# Altium schematic sheet Xcore10.SchDoc
size A
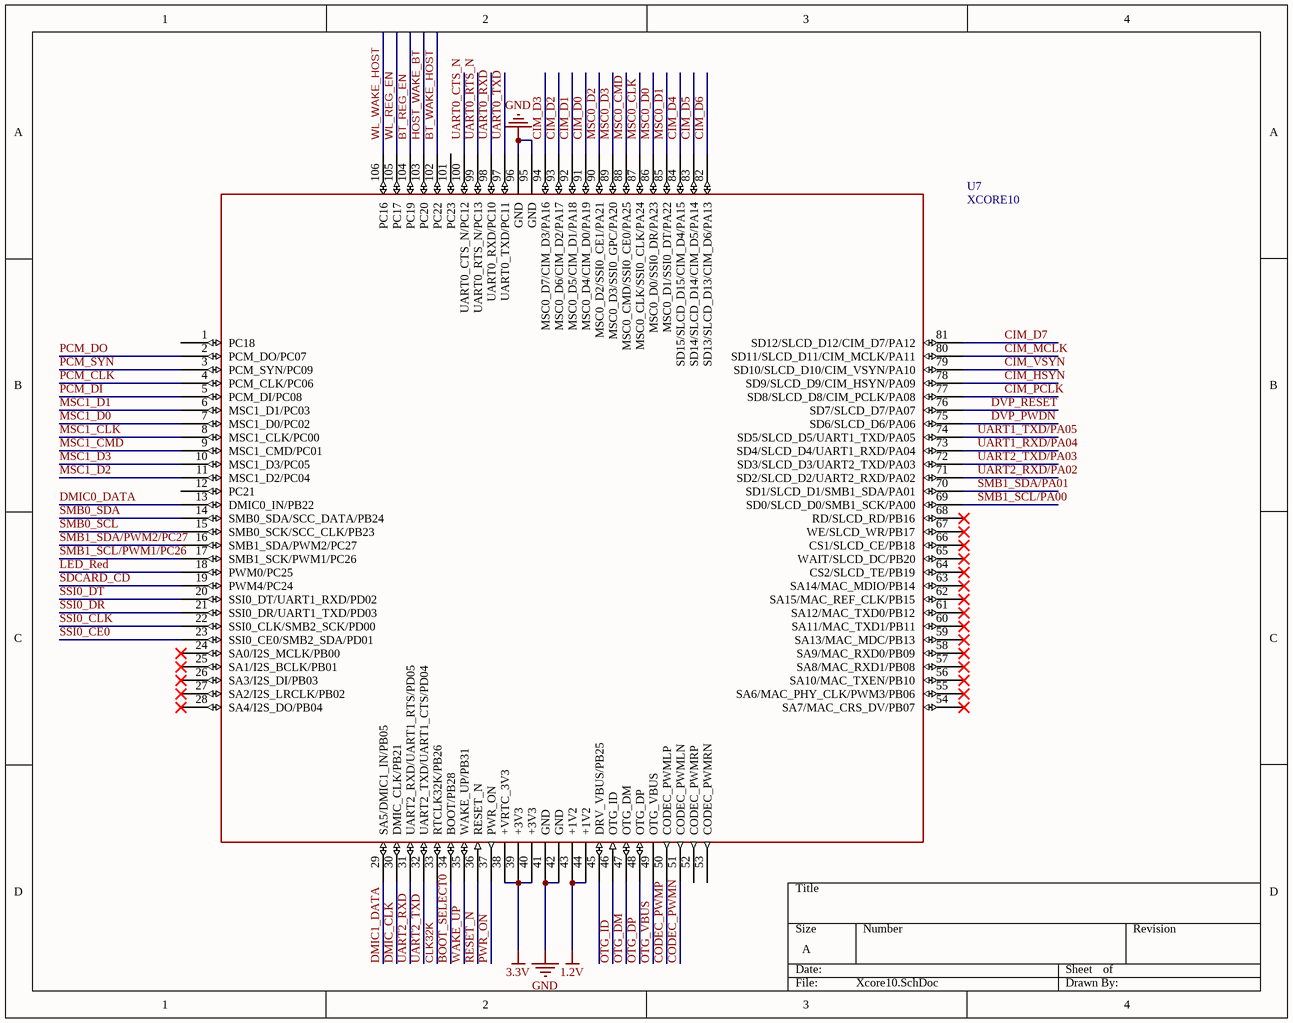
[diagram p0: Xcore10.SchDoc]

## Parts
U7  XCORE10  [CORE-32*26-1.0]

## Nets
1.2V: U7.43(+1V2) U7.44(+1V2)
3.3V: U7.38(+VRTC_3V3) U7.39(+3V3) U7.40(+3V3)
GND: U7.41(GND) U7.42(GND) U7.95(GND) U7.96(GND)
BOOT_SELECT0: U7.34(BOOT/PB28)
BT_REG_EN: U7.104(PC19)
BT_WAKE_HOST: U7.102(PC22)
CIM_D0: U7.91(MSC0_D4/CIM_D0/PA19)
CIM_D1: U7.92(MSC0_D5/CIM_D1/PA18)
CIM_D2: U7.93(MSC0_D6/CIM_D2/PA17)
CIM_D3: U7.94(MSC0_D7/CIM_D3/PA16)
CIM_D4: U7.84(SD15/SLCD_D15/CIM_D4/PA15)
CIM_D5: U7.83(SD14/SLCD_D14/CIM_D5/PA14)
CIM_D6: U7.82(SD13/SLCD_D13/CIM_D6/PA13)
CIM_D7: U7.81(SD12/SLCD_D12/CIM_D7/PA12)
CIM_HSYN: U7.78(SD9/SLCD_D9/CIM_HSYN/PA09)
CIM_MCLK: U7.80(SD11/SLCD_D11/CIM_MCLK/PA11)
CIM_PCLK: U7.77(SD8/SLCD_D8/CIM_PCLK/PA08)
CIM_VSYN: U7.79(SD10/SLCD_D10/CIM_VSYN/PA10)
CLK32K: U7.33(RTCLK32K/PB26)
CODEC_PWMN: U7.51(CODEC_PWMLN)
CODEC_PWMP: U7.50(CODEC_PWMLP)
DMIC0_DATA: U7.13(DMIC0_IN/PB22)
DMIC1_DATA: U7.29(SA5/DMIC1_IN/PB05)
DMIC_CLK: U7.30(DMIC_CLK/PB21)
DVP_PWDN: U7.75(SD6/SLCD_D6/PA06)
DVP_RESET: U7.76(SD7/SLCD_D7/PA07)
HOST_WAKE_BT: U7.103(PC20)
LED_Red: U7.18(PWM0/PC25)
MSC0_CLK: U7.87(MSC0_CLK/SSI0_CLK/PA24)
MSC0_CMD: U7.88(MSC0_CMD/SSI0_CE0/PA25)
MSC0_D0: U7.86(MSC0_D0/SSI0_DR/PA23)
MSC0_D1: U7.85(MSC0_D1/SSI0_DT/PA22)
MSC0_D2: U7.90(MSC0_D2/SSI0_CE1/PA21)
MSC0_D3: U7.89(MSC0_D3/SSI0_GPC/PA20)
MSC1_CLK: U7.8(MSC1_CLK/PC00)
MSC1_CMD: U7.9(MSC1_CMD/PC01)
MSC1_D0: U7.7(MSC1_D0/PC02)
MSC1_D1: U7.6(MSC1_D1/PC03)
MSC1_D2: U7.11(MSC1_D2/PC04)
MSC1_D3: U7.10(MSC1_D3/PC05)
OTG_DM: U7.47(OTG_DM)
OTG_DP: U7.48(OTG_DP)
OTG_ID: U7.46(OTG_ID)
OTG_VBUS: U7.49(OTG_VBUS)
PCM_CLK: U7.4(PCM_CLK/PC06)
PCM_DI: U7.5(PCM_DI/PC08)
PCM_DO: U7.2(PCM_DO/PC07)
PCM_SYN: U7.3(PCM_SYN/PC09)
PWR_ON: U7.37(PWR_ON)
RESET_N: U7.36(RESET_N)
SDCARD_CD: U7.19(PWM4/PC24)
SMB0_SCL: U7.15(SMB0_SCK/SCC_CLK/PB23)
SMB0_SDA: U7.14(SMB0_SDA/SCC_DATA/PB24)
SMB1_SCL/PA00: U7.69(SD0/SLCD_D0/SMB1_SCK/PA00)
SMB1_SCL/PWM1/PC26: U7.17(SMB1_SCK/PWM1/PC26)
SMB1_SDA/PA01: U7.70(SD1/SLCD_D1/SMB1_SDA/PA01)
SMB1_SDA/PWM2/PC27: U7.16(SMB1_SDA/PWM2/PC27)
SSI0_CE0: U7.23(SSI0_CE0/SMB2_SDA/PD01)
SSI0_CLK: U7.22(SSI0_CLK/SMB2_SCK/PD00)
SSI0_DR: U7.21(SSI0_DR/UART1_TXD/PD03)
SSI0_DT: U7.20(SSI0_DT/UART1_RXD/PD02)
UART0_CTS_N: U7.100(UART0_CTS_N/PC12)
UART0_RTS_N: U7.99(UART0_RTS_N/PC13)
UART0_RXD: U7.98(UART0_RXD/PC10)
UART0_TXD: U7.97(UART0_TXD/PC11)
UART1_RXD/PA04: U7.73(SD4/SLCD_D4/UART1_RXD/PA04)
UART1_TXD/PA05: U7.74(SD5/SLCD_D5/UART1_TXD/PA05)
UART2_RXD: U7.31(UART2_RXD/UART1_RTS/PD05)
UART2_RXD/PA02: U7.71(SD2/SLCD_D2/UART2_RXD/PA02)
UART2_TXD: U7.32(UART2_TXD/UART1_CTS/PD04)
UART2_TXD/PA03: U7.72(SD3/SLCD_D3/UART2_TXD/PA03)
WAKE_UP: U7.35(WAKE_UP/PB31)
WL_REG_EN: U7.105(PC17)
WL_WAKE_HOST: U7.106(PC16)

Not connected (* = marked no-connect by the designer): U7 1(PC18) 12(PC21) 24(SA0/I2S_MCLK/PB00)* 25(SA1/I2S_BCLK/PB01)* 26(SA3/I2S_DI/PB03)* 27(SA2/I2S_LRCLK/PB02)* 28(SA4/I2S_DO/PB04)* 45(DRV_VBUS/PB25) 52(CODEC_PWMRP) 53(CODEC_PWMRN) 54(SA7/MAC_CRS_DV/PB07)* 55(SA6/MAC_PHY_CLK/PWM3/PB06)* 56(SA10/MAC_TXEN/PB10)* 57(SA8/MAC_RXD1/PB08)* 58(SA9/MAC_RXD0/PB09)* 59(SA13/MAC_MDC/PB13)* 60(SA11/MAC_TXD1/PB11)* 61(SA12/MAC_TXD0/PB12)* 62(SA15/MAC_REF_CLK/PB15)* 63(SA14/MAC_MDIO/PB14)* 64(CS2/SLCD_TE/PB19)* 65(WAIT/SLCD_DC/PB20)* 66(CS1/SLCD_CE/PB18)* 67(WE/SLCD_WR/PB17)* 68(RD/SLCD_RD/PB16)* 101(PC23)